# EAGLE design Connector_Board (EAGLE 9.5.2)
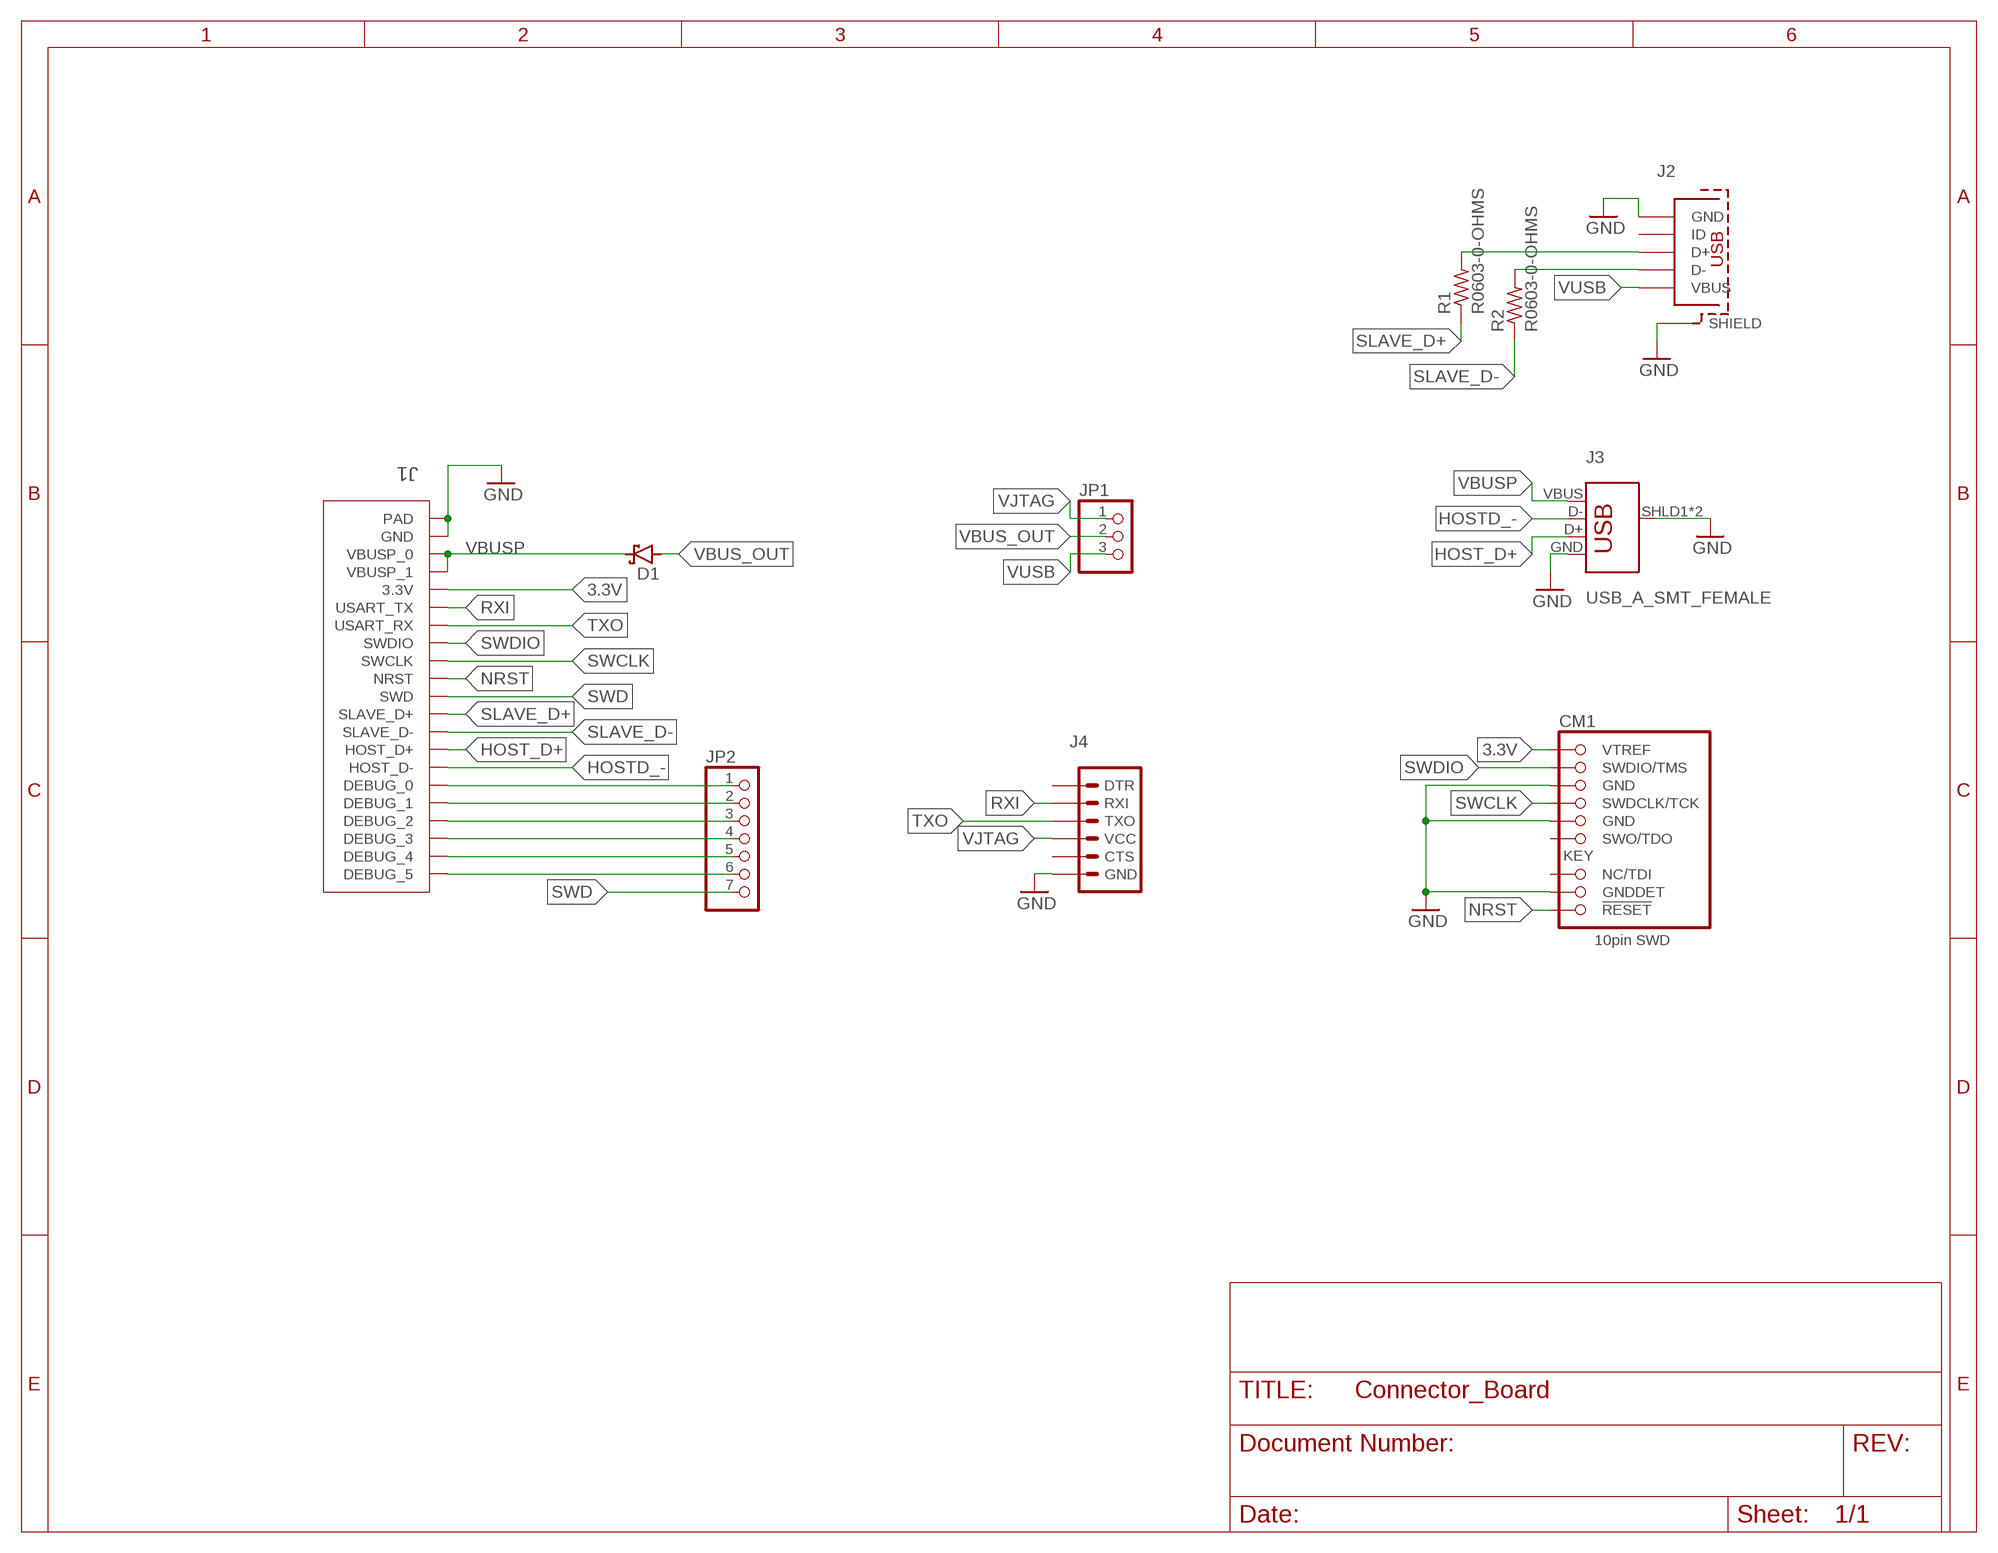
[diagram p0: schematic, sheet 1]

## Parts
CM1  FTSH-105-XX-X-DV-K  [CON10_2X5_DUK_FTSH]
D1  CDBU0520  [DIOC1709X85N]
J1  2-1734592-0  [TE_2-1734592-0]
J2  MICRO-USB-SOCKET  [629105136821]
J3  USB_A_SMT_FEMALE  [USB-A-S-SILK-FEMALE]
J4  6_PIN_SERIAL_TARGETSILK  [6_PIN_SERIAL_TARGET_SIDE_W_SILK]
JP1  PINHD-1X3  [1X03]
JP2  PINHD-1X7  [1X07]
R1  R0603-0-OHMS  [.0603-C-NOSILK]
R2  R0603-0-OHMS  [.0603-C-NOSILK]

## Nets
3.3V: CM1.1(VTREF) J1.17(3.3V)
GND: CM1.3(GND) CM1.5(GND) CM1.9(GNDDET) J1.20(GND) J1.S1(PAD) J1.S2(PAD) J2.5(GND) J2.SHELL1(SHIELD) J2.SHELL2(SHIELD) J2.SHELL3(SHIELD) J2.SHELL(SHIELD) J3.GND J3.SHLD1(SHIELD) J3.SHLD2(SHIELD) J4.P$6(GND)
HOST_D+: J1.8(HOST_D+) J3.D+
HOSTD_-: J1.7(HOST_D-) J3.D-
N$1: J1.6(DEBUG_0) JP2.1
N$2: J1.5(DEBUG_1) JP2.2
N$3: J1.4(DEBUG_2) JP2.3
N$4: J2.2(D-) R2.2
N$5: J2.3(D+) R1.2
N$6: J1.3(DEBUG_3) JP2.4
N$7: J1.2(DEBUG_4) JP2.5
N$8: J1.1(DEBUG_5) JP2.6
NRST: CM1.10(!RESET) J1.12(NRST)
RXI: J1.16(USART_TX) J4.P$3(RXI)
SLAVE_D+: J1.10(SLAVE_D+) R1.1
SLAVE_D-: J1.9(SLAVE_D-) R2.1
SWCLK: CM1.4(SWDCLK/TCK) J1.13(SWCLK)
SWD: J1.11(SWD) JP2.7
SWDIO: CM1.2(SWDIO/TMS) J1.14(SWDIO)
TXO: J1.15(USART_RX) J4.P$2(TXO)
VBUS_OUT: D1.2(A) JP1.2
VBUSP: D1.1(C) J1.18(VBUSP_1) J1.19(VBUSP_0) J3.VBUS
VJTAG: J4.P$4(VCC) JP1.1
VUSB: J2.1(VBUS) JP1.3
Unconnected: CM1.6(SWO/TDO) CM1.8(NC/TDI) J2.4(ID) J4.P$1(DTR) J4.P$5(CTS)

## Library data of the parts
CM1 = J-Samtec-FTSH-105-XXX-DV-K-ARM-SWD:FTSH-105-XX-X-DV-K
D1 = D-Comchip_Schottky_Diode_CDBU0520:CDBU0520: COMCHIP TECHNOLOGY CDBU0520, SMT Schottky Diode, 30V 0.5A, 2-Pin SOD-523F (0603) Source: Datasheet <http://www.comchiptech.com/admin/files/product/CDBU0520-HF-RevA797161.pdf>; ALLIED_NUMBER: 70426688; ALLIED_PRICE-STOCK: https://www.alliedelec.com/comchiptechnology-cdbu0520/70426688/; DESCRIPTION: COMCHIP TECHNOLOGY CDBU0520, SMT Schottky Diode, 30V 0.5A, 2-Pin SOD-523F (0603); HEIGHT: 0.85mm; MANUFACTURER_NAME: Comchip Technology; MANUFACTURER_PART_NUMBER: CDBU0520; MOUSER_PART_NUMBER: 750-CDBU0520; MOUSER_PRICE-STOCK: https://www.mouser.com/Search/Refine.aspx?Keyword=750-CDBU0520; RS_PART_NUMBER: 9066848; RS_PRICE-STOCK: http://uk.rs-online.com/web/p/products/9066848
J1 = oresat-edge_connector:2-1734592-0
J2 = J-Wurth-629105136821-Micro-USB-A:MICRO-USB-SOCKET: WR-COM SMT Horizontal 5 Contacts Micro USB Type B,5 pins=>Code : Con_I-O_COM_MicroUSB_629105136821 <http://katalog.we-online.de/media/images/eican/Con_I-O_COM_MicroUSB_629105136821_pf2.jpg> Details see: http://katalog.we-online.de/en/em/COM_MICRO_SMT_TYPE_B_HORIZONTAL/629105136821?m Created 2014-07-09, Karrer Zheng 2014 (C) Würth Elektronik
J3 = SparkFun-Connectors:USB_A: USB-A Connector Male and female variants, as well as PTH and SMT variants SparkFun Products: SparkFun XBee Explorer Dongle <https://www.sparkfun.com/products/11697> PTH Male SparkFun MicroView-USB Programmer <https://www.sparkfun.com/products/12924> SMT Male SparkFun USB Type A Female Breakout <https://www.sparkfun.com/products/12700> SMT Female; PROD_ID: CONN-09520; SF_ID: PRT-09011
J4 = SparkFun-Connectors:6_PIN_SERIAL_TARGET: 6-pin header connection for use with the "FTDI BASIC" pinout - TARGET SIDE. Also known as "Arduino Serial Program Header". It is used to mate with our FTDI Basic serial programmers using the Arduino IDE. Note, this device has "TARGET" in the name. It is intended to be used on a design that contains a target micro-controller that you wish to program. The "sister" device, named "CABLE" is inteneded to be used on a design that usually lives on the end of your USB cable and prvides the converter chip (FTDI232 or FTDI231x) to commnicate serial RX/TX. You can populate with some of these: Break Away Headers - Straight <https://www.sparkfun.com/products/116> (PRT-00116) For reference (or to suit your programming needs) check out these designs: SparkFun FTDI Basic Breakout - 5V <https://www.sparkfun.com/products/9716> (DEV-09716) SparkFun FTDI Basic Breakout - 3.3V <https://www.sparkfun.com/products/9873> (DEV-09873) SparkFun FTDI SmartBasic <https://www.sparkfun.com/products/12935> (DEV-12935) SparkFun Beefy 3 - FTDI Basic Breakout <https://www.sparkfun.com/products/13746> (DEV-13746)
JP1 = pinhead:PINHD-1X3: PIN HEADER
JP2 = pinhead:PINHD-1X7: PIN HEADER
R1 R2 = C3_SamacSys_Parts:R0603-0-OHMS: Thick Film Resistors - SMD Source: Datasheet <https://www.vishay.com/docs/28773/crcwce3.pdf>; DESCRIPTION: Thick Film Resistors - SMD; HEIGHT: 0.55mm; MANUFACTURER_NAME: Vishay; MANUFACTURER_PART_NUMBER: CRCW06030000Z0EAC; MOUSER_PART_NUMBER: 71-CRCW06030000Z0EAC; MOUSER_PRICE-STOCK: https://www.mouser.com/Search/Refine.aspx?Keyword=71-CRCW06030000Z0EAC

## Board
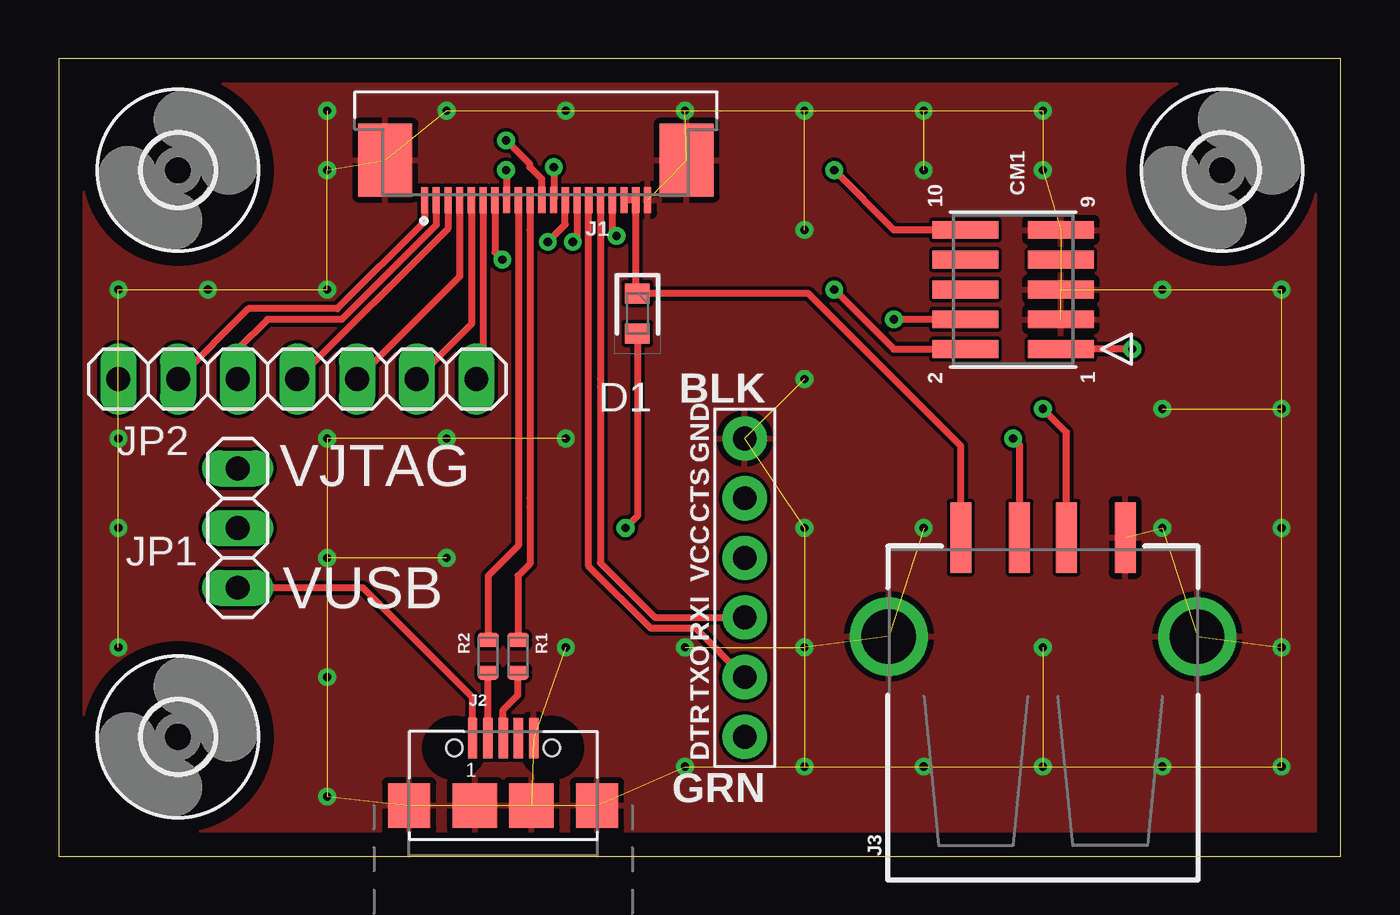
[diagram p1: board, top side]
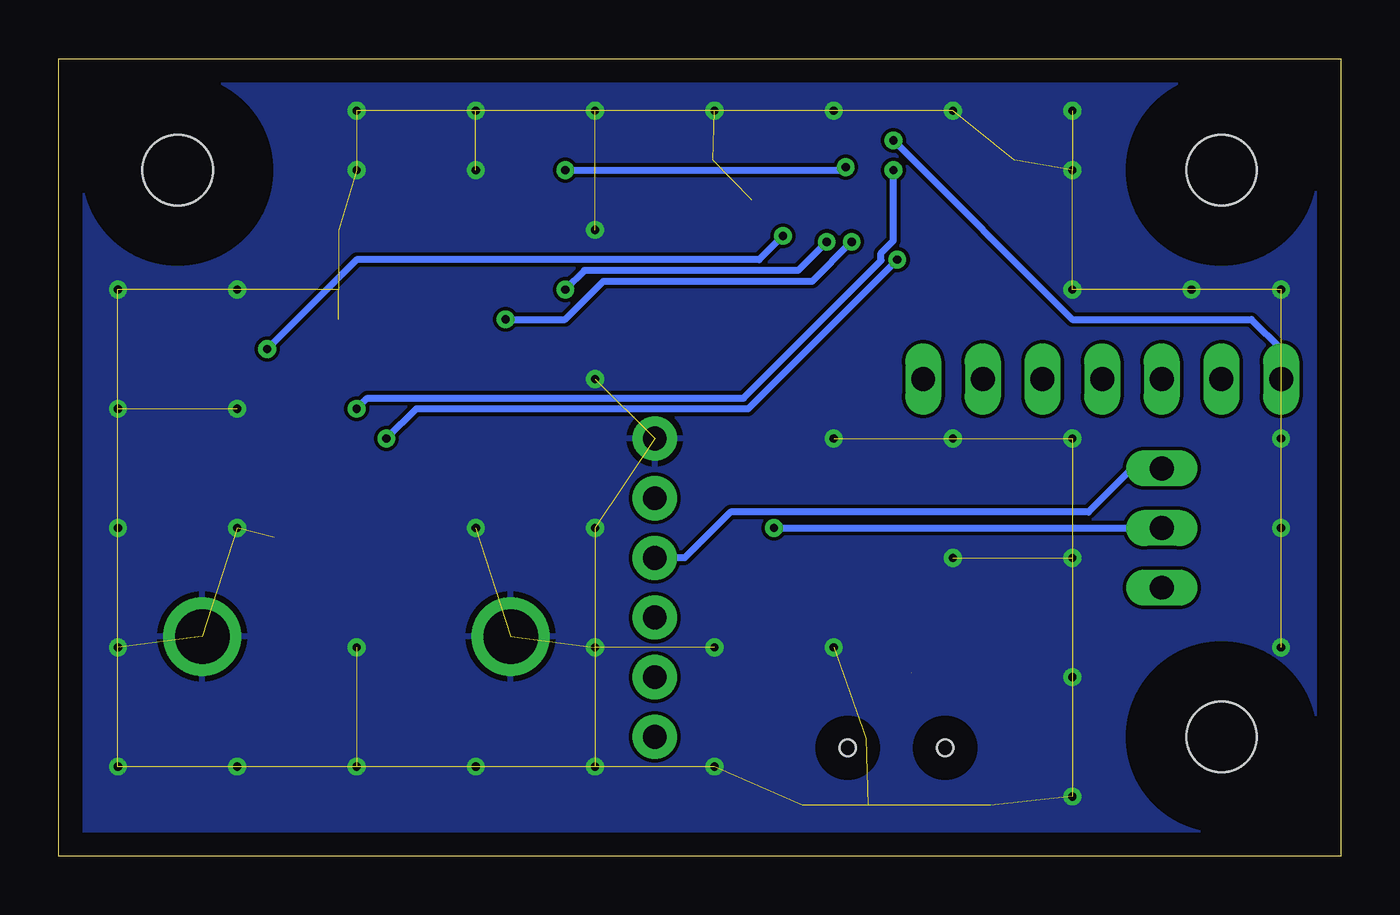
[diagram p2: board, bottom side, seen from below]

Size 54.59 x 33.96 mm. Coordinates in mm from the lower left corner, seen from the top.
Outline: 0,0 54.59,0 54.59,33.96 0,33.96 0,0
Copper layers (1*16): Top 0.035mm / dielectric 1.5mm / Bottom 0.035mm
Design rules "default": minimum track width 6mil, minimum drill 0.35mm, track to track 6mil, track to pad 6mil, pad to pad 6mil, via to via 6mil, smd to smd 6mil, copper to edge 40mil, drill to drill 6mil, minimum pad ring 10mil, minimum via ring 8mil, stop-mask expansion 4mil, vias tented up to drill 0mil, thermal gap 10mil

### Footprints (pad centres in the part's own frame; a part is rotated, then mirrored left to right if it is on the bottom)
CON10_2X5_DUK_FTSH = smd 0.762 x 2.794: 1 -2.54,-2.032; 2 -2.54,2.032; 3 -1.27,-2.032; 4 -1.27,2.032; 5 0,-2.032; 6 0,2.032; 7 1.27,-2.032; 8 1.27,2.032; 9 2.54,-2.032; 10 2.54,2.032
DIOC1709X85N = smd 0.85 x 1.05: 1 -0.85,0; 2 0.85,0
TE_2-1734592-0 = smd 0.3 x 1.1: 1 -4.75,0; 2 -4.25,0; 3 -3.75,0; 4 -3.25,0; 5 -2.75,0; 6 -2.25,0; 7 -1.75,0; 8 -1.25,0; 9 -0.75,0; 10 -0.25,0; 11 0.25,0; 12 0.75,0; 13 1.25,0; 14 1.75,0; 15 2.25,0; 16 2.75,0; 17 3.25,0; 18 3.75,0; 19 4.25,0; 20 4.75,0 | smd 2.3 x 3.1: S1 6.42,1.7; S2 -6.42,1.7
629105136821 = smd 0.4 x 1.731: 1 -1.3,2.865; 2 -0.65,2.865; 3 0,2.865; 4 0.65,2.865; 5 1.3,2.865 | smd 1.8 x 1.9: SHELL -4,0; SHELL3 4,0 | smd 1.9 x 1.9: SHELL1 -1.2,0; SHELL2 1.2,0 | hole 0.7: -2.075,2.45; 2.075,2.45
USB-A-S-SILK-FEMALE = smd 3 x 0.9: D+ 7.212,-1; D- 7.212,1; GND 7.212,-3.5; VBUS 7.212,3.5 | drill 2.311: SHLD1 3,-6.566; SHLD2 3,6.566
6_PIN_SERIAL_TARGET_SIDE_W_SILK = drill 1.016 pad 1.88: P$1 -6.35,0; P$2 -3.81,0; P$3 -1.27,0; P$4 1.27,0; P$5 3.81,0; P$6 6.35,0
1X03 = drill 1.016 long: 1 -2.54,0; 2 0,0; 3 2.54,0
1X07 = drill 1.016 long: 1 -7.62,0; 2 -5.08,0; 3 -2.54,0; 4 0,0; 5 2.54,0; 6 5.08,0; 7 7.62,0
.0603-C-NOSILK = smd 0.6 x 0.9: 1 -0.7,0; 2 0.7,0
3,0 = hole 3: 0,0

### Placement (x,y rotation side)
CM1  40.64,24.13 90 top
D1  24.64,23.11 270 top
J1  20.32,27.94 0 top
J2  18.92,2.16 0 top
J3  41.91,6.35 90 top
J4  29.21,11.43 90 top
JP1  7.62,13.97 270 top
JP2  10.16,20.32 180 top
R1  19.56,8.51 270 top
R2  18.29,8.51 270 top
U$1  [3,0]  5.08,5.08 0 top
U$2  [3,0]  5.08,29.21 0 top
U$3  [3,0]  49.53,29.21 0 top

### Tracks (layer width: path | path; a pad name or v marks a point on that pad's centre or on a via)
3.3V  (via drill 0.35)
  Top 0.305: J1.17 23.57,26.6 v23.75,26.42 | v45.72,21.59 CM1.1
  Bottom 0.305: v23.75,26.42 24.77,25.4 41.91,25.4 v45.72,21.59
GND  (via drill 0.35)  (58 unrouted)
  other vias: 52.07,24.13 52.07,19.05 52.07,13.97 52.07,8.89 52.07,3.81 46.99,24.13 46.99,19.05 46.99,13.97 46.99,3.81 41.91,8.89 41.91,3.81 36.83,3.81 36.83,13.97 31.75,13.97 31.75,8.89 31.75,3.81 31.75,20.32 31.75,26.67 26.67,3.81 26.67,8.89 2.54,8.89 41.91,29.21 36.83,29.21 31.75,31.75 36.83,31.75 41.91,31.75 26.67,31.75 21.59,31.75 16.51,31.75 11.43,31.75 11.43,29.21 11.43,24.13 6.35,24.13 2.54,24.13 2.54,13.97 2.54,17.78 11.43,17.78 21.59,8.89 16.51,17.78 21.59,17.78 16.51,12.7 11.43,12.7 11.43,7.62 11.43,2.54
  pour Top: -1.27,34.29 55.88,34.29 55.88,-1.27 -1.27,-1.27
  pour Bottom: -1.27,34.29 55.88,34.29 55.88,-1.27 -1.27,-1.27
HOST_D+  (via drill 0.35)
  Top 0.305: J3.D+ 42.91,18.05 v41.91,19.05 | v19.05,29.21 19.07,29.19 J1.8
  Bottom 0.305: v41.91,19.05 41.45,19.51 26.67,19.51 26.21,19.51 25.43,19.51 19.57,25.36 19.57,25.68 19.05,26.2 v19.05,29.21
HOSTD_-  (via drill 0.35)
  Top 0.305: J1.7 18.57,25.72 v18.89,25.4 | v40.64,17.78 40.91,17.51 J3.D-
  Bottom 0.305: v18.89,25.4 25.24,19.05 39.37,19.05 v40.64,17.78
N$1
  Top 0.305: J1.6 18.07,20.61 JP2.1
N$2
  Top 0.305: J1.5 17.57,22.65 JP2.2
N$3
  Top 0.305: J1.4 17.07,24.69 JP2.3
N$4  (1 unrouted)
  Top 0.305: R2.2 18.27,7.79 J2.2
N$5
  Top 0.305: J2.3 18.92,6.22 19.56,6.86 R1.2
N$6
  Top 0.305: J1.3 16.57,26.73 JP2.4
N$7
  Top 0.305: J1.2 16.07,26.88 12.05,22.86 8.89,22.86 7.62,21.59 JP2.5
N$8
  Top 0.305: J1.1 15.57,27.02 11.86,23.32 8.08,23.32 JP2.6
NRST  (via drill 0.35)
  Top 0.305: CM1.10 35.56,26.67 v33.02,29.21 | v21.08,29.34 21.08,27.95 J1.12
  Bottom 0.305: v33.02,29.21 21.21,29.21 v21.08,29.34
RXI
  Top 0.305: J1.16 23.07,20.32 23.07,19.99 23.07,12.49 25.4,10.16 J4.P$3
SLAVE_D+
  Top 0.305: J1.10 20.07,26.67 20.07,15.24 20.07,14.86 20.07,12.45 19.56,11.94 R1.1
SLAVE_D-
  Top 0.305: J1.9 19.57,13.22 18.29,11.94 R2.1
SWCLK  (via drill 0.35)
  Top 0.305: CM1.4 v35.56,22.86 | v20.83,26.16 21.57,26.9 J1.13
  Bottom 0.305: v35.56,22.86 33.02,22.86 31.39,24.49 22.5,24.49 v20.83,26.16
SWD  (via drill 0.35)
  Top 0.305: J1.11 20.57,28.83 20.07,29.34 20.07,29.46 v19.05,30.48
  Bottom 0.305: v19.05,30.48 11.43,22.86 3.81,22.86 2.54,21.59 JP2.7
SWDIO  (via drill 0.35)
  Top 0.305: J1.14 22.07,26.34 v21.89,26.16 | v33.02,24.13 35.56,21.59 CM1.2
  Bottom 0.305: v21.89,26.16 23.11,24.94 32.21,24.94 v33.02,24.13
TXO
  Top 0.305: J4.P$2 27.13,9.7 25.21,9.7 22.57,12.34 J1.15
VBUS_OUT  (via drill 0.35)
  Top 0.305: D1.2 24.64,14.48 v24.13,13.97
  Bottom 0.305: v24.13,13.97 JP1.2
VBUSP
  Top 0.305: J1.18 J1.19 24.57,24.03 D1.1 31.92,23.96 38.41,17.47 J3.VBUS
VJTAG
  Bottom 0.305: JP1.1 8.89,16.51 10.75,14.65 25.99,14.65 27.94,12.7 J4.P$4
VUSB
  Top 0.305: J2.1 17.62,6.76 12.95,11.43 JP1.3

### Text on the board
tPlace: VJTAG | VUSB